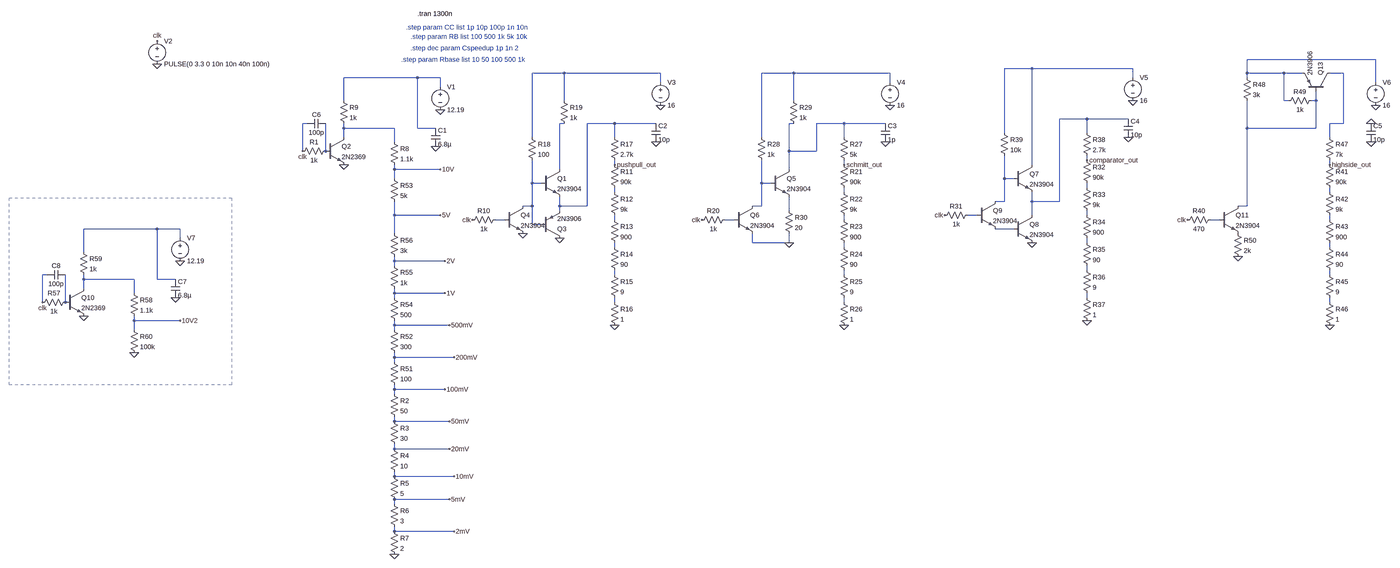
[diagram p0: schematic voltage_output.asc, whole sheet]
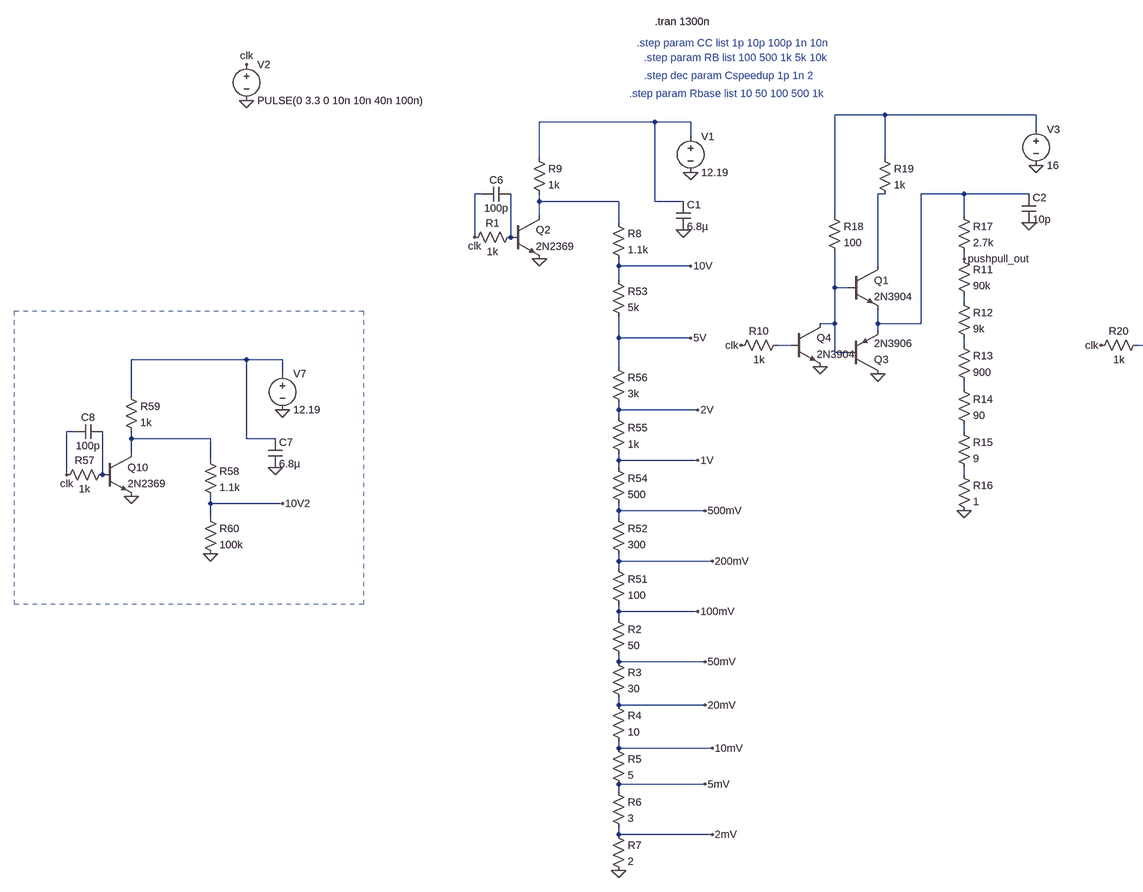
[diagram p1: schematic voltage_output.asc, part, row 1 of 1, column 1 of 2]
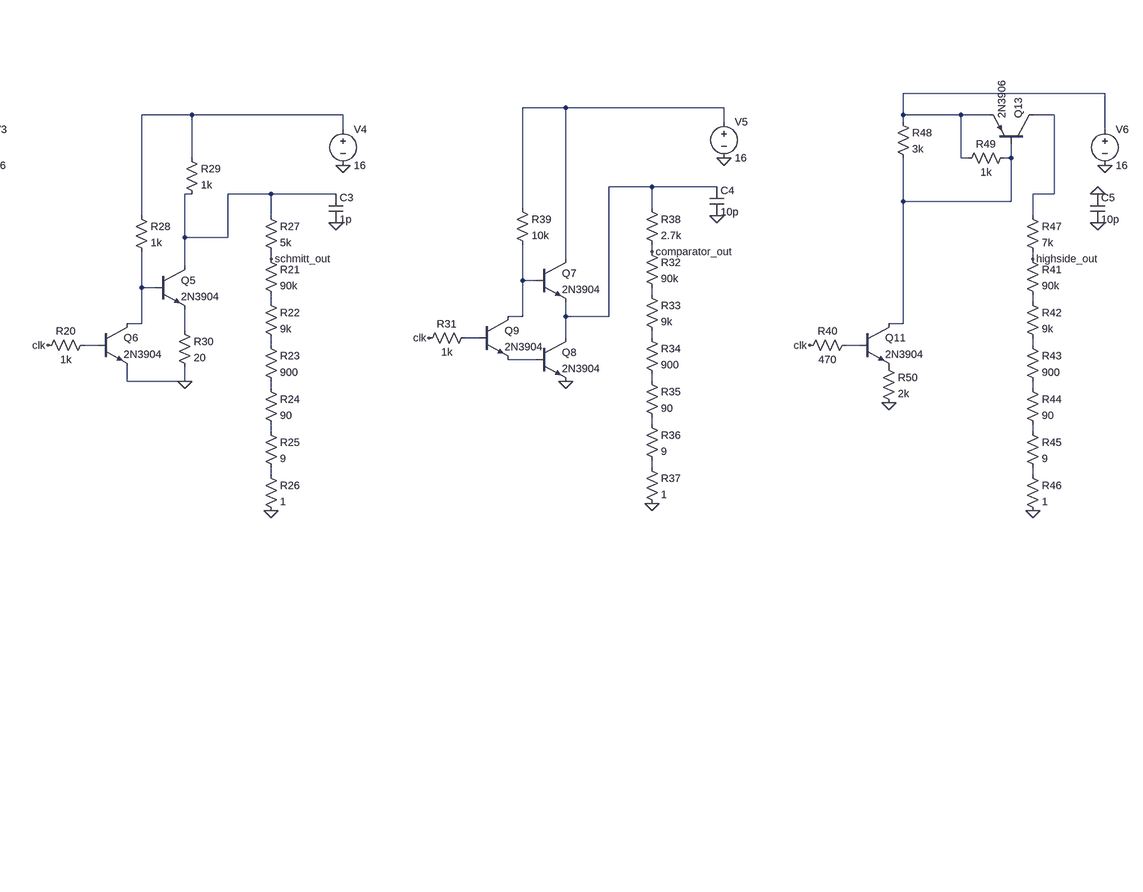
[diagram p2: schematic voltage_output.asc, part, row 1 of 1, column 2 of 2]
voltage_output.asc, the LTspice schematic file:
Version 4
SHEET 1 4044 1824
WIRE 3984 80 3536 80
WIRE 2784 112 2688 112
WIRE 3136 112 2784 112
WIRE 1120 128 1008 128
WIRE 1456 128 1120 128
WIRE 1920 128 1808 128
WIRE 2256 128 1920 128
WIRE 3536 128 3536 80
WIRE 3664 128 3536 128
WIRE 3728 128 3664 128
WIRE 3872 128 3824 128
WIRE 608 144 352 144
WIRE 688 144 608 144
WIRE 3136 144 3136 112
WIRE 3536 144 3536 128
WIRE 1456 160 1456 128
WIRE 2256 160 2256 128
WIRE 3984 160 3984 80
WIRE 688 176 688 144
WIRE 352 224 352 144
WIRE 1120 224 1120 128
WIRE 1920 224 1920 128
WIRE 3664 224 3664 128
WIRE 3680 224 3664 224
WIRE 3776 224 3776 192
WIRE 3776 224 3760 224
WIRE 2976 288 2880 288
WIRE 3120 288 2976 288
WIRE 224 304 208 304
WIRE 1120 304 1104 304
WIRE 1296 304 1200 304
WIRE 1440 304 1296 304
WIRE 1920 304 1904 304
WIRE 2096 304 2000 304
WIRE 2240 304 2096 304
WIRE 3872 304 3872 128
WIRE 3872 304 3824 304
WIRE 352 320 352 304
WIRE 528 320 352 320
WIRE 608 320 608 144
WIRE 672 320 608 320
WIRE 3536 320 3536 224
WIRE 3776 320 3776 224
WIRE 3776 320 3536 320
WIRE 2688 336 2688 112
WIRE 2976 336 2976 288
WIRE 352 352 352 320
WIRE 1008 352 1008 128
WIRE 1296 352 1296 304
WIRE 1808 352 1808 128
WIRE 2096 352 2096 304
WIRE 3824 352 3824 304
WIRE 528 368 528 320
WIRE 208 400 208 304
WIRE 288 400 288 304
WIRE 1904 400 1904 304
WIRE 2000 400 2000 304
WIRE 2000 400 1904 400
WIRE 2976 432 2976 416
WIRE 1296 448 1296 432
WIRE 2096 448 2096 432
WIRE 2784 448 2784 112
WIRE 3824 448 3824 432
WIRE 528 464 528 448
WIRE 688 464 528 464
WIRE 1104 464 1104 304
WIRE 1904 464 1904 400
WIRE 528 496 528 464
WIRE 2688 496 2688 416
WIRE 2720 496 2688 496
WIRE 1008 512 1008 432
WIRE 1040 512 1008 512
WIRE 1808 512 1808 432
WIRE 1840 512 1808 512
WIRE 2976 528 2976 512
WIRE 1296 544 1296 528
WIRE 2096 544 2096 528
WIRE 3824 544 3824 528
WIRE 2688 576 2688 496
WIRE 2688 576 2656 576
WIRE 2784 576 2784 544
WIRE 2880 576 2880 288
WIRE 2880 576 2784 576
WIRE 1008 592 1008 512
WIRE 1008 592 976 592
WIRE 1104 592 1104 560
WIRE 1200 592 1200 304
WIRE 1200 592 1104 592
WIRE 1808 592 1808 512
WIRE 1808 592 1776 592
WIRE 3536 592 3536 320
WIRE 3536 592 3504 592
WIRE 1104 608 1104 592
WIRE 1904 608 1904 560
WIRE 528 624 528 576
WIRE 688 624 528 624
WIRE 2592 624 2560 624
WIRE 2784 624 2784 576
WIRE 2976 624 2976 608
WIRE 912 640 880 640
WIRE 1296 640 1296 624
WIRE 1712 640 1680 640
WIRE 2096 640 2096 624
WIRE 3440 640 3408 640
WIRE 3824 640 3824 624
WIRE 1008 656 1008 592
WIRE 1040 656 1008 656
WIRE -464 672 -720 672
WIRE -384 672 -464 672
WIRE 2720 672 2656 672
WIRE 528 688 528 624
WIRE -384 704 -384 672
WIRE 1776 720 1776 688
WIRE 1904 720 1904 688
WIRE 1904 720 1776 720
WIRE 2976 720 2976 704
WIRE 1296 736 1296 720
WIRE 2096 736 2096 720
WIRE 3824 736 3824 720
WIRE -720 752 -720 672
WIRE 528 784 528 768
WIRE 704 784 528 784
WIRE 528 800 528 784
WIRE 2976 816 2976 800
WIRE -848 832 -864 832
WIRE 1296 832 1296 816
WIRE 2096 832 2096 816
WIRE 3824 832 3824 816
WIRE -720 848 -720 832
WIRE -544 848 -720 848
WIRE -464 848 -464 672
WIRE -400 848 -464 848
WIRE -720 880 -720 848
WIRE -544 896 -544 848
WIRE 528 896 528 880
WIRE 704 896 528 896
WIRE 528 912 528 896
WIRE 2976 912 2976 896
WIRE -864 928 -864 832
WIRE -784 928 -784 832
WIRE 1296 928 1296 912
WIRE 2096 928 2096 912
WIRE 3824 928 3824 912
WIRE -544 992 -544 976
WIRE -384 992 -544 992
WIRE 528 1008 528 992
WIRE 720 1008 528 1008
WIRE -544 1024 -544 992
WIRE 528 1024 528 1008
WIRE 528 1120 528 1104
WIRE 736 1120 528 1120
WIRE 528 1136 528 1120
WIRE 528 1232 528 1216
WIRE 704 1232 528 1232
WIRE 528 1248 528 1232
WIRE 528 1344 528 1328
WIRE 720 1344 528 1344
WIRE 528 1440 528 1424
WIRE 720 1440 528 1440
WIRE 528 1536 528 1520
WIRE 736 1536 528 1536
WIRE 720 1616 528 1616
WIRE 528 1632 528 1616
WIRE 528 1728 528 1712
WIRE 736 1728 528 1728
FLAG -464 96 0
FLAG -464 16 clk
FLAG 352 448 0
FLAG 528 1808 0
FLAG 688 256 0
FLAG 208 400 clk
FLAG 672 384 0
FLAG 1104 704 0
FLAG 1296 1008 0
FLAG 1456 240 0
FLAG 800 640 clk
FLAG 1440 368 0
FLAG 976 688 0
FLAG 1296 448 pushpull_out
FLAG 688 464 10V
FLAG 2096 1008 0
FLAG 2256 240 0
FLAG 1600 640 clk
FLAG 2240 368 0
FLAG 2096 448 schmitt_out
FLAG 1904 720 0
FLAG 2976 992 0
FLAG 3136 224 0
FLAG 2480 624 clk
FLAG 3120 352 0
FLAG 2784 720 0
FLAG 2976 432 comparator_out
FLAG 3824 1008 0
FLAG 3984 240 0
FLAG 3328 640 clk
FLAG 3968 368 0
FLAG 3824 448 highside_out
FLAG 3968 304 0
FLAG 3504 768 0
FLAG 688 624 5V
FLAG 704 784 2V
FLAG 736 1728 2mV
FLAG 720 1616 5mV
FLAG 736 1536 10mV
FLAG 720 1440 20mV
FLAG 720 1344 50mV
FLAG 704 1232 100mV
FLAG 736 1120 200mV
FLAG 720 1008 500mV
FLAG 704 896 1V
FLAG -720 976 0
FLAG -384 784 0
FLAG -864 928 clk
FLAG -400 912 0
FLAG -384 992 10V2
FLAG -544 1104 0
SYMBOL voltage -464 0 R0
SYMATTR InstName V2
SYMATTR Value PULSE(0 3.3 0 10n 10n 40n 100n)
SYMBOL npn 288 352 R0
SYMATTR InstName Q2
SYMATTR Value 2N2369
SYMBOL res 304 384 R90
WINDOW 0 0 56 VBottom 2
WINDOW 3 32 56 VTop 2
SYMATTR InstName R1
SYMATTR Value 1k
SYMBOL res 512 1232 R0
SYMATTR InstName R2
SYMATTR Value 50
SYMBOL res 512 1328 R0
SYMATTR InstName R3
SYMATTR Value 30
SYMBOL res 512 1424 R0
SYMATTR InstName R4
SYMATTR Value 10
SYMBOL res 512 1520 R0
SYMATTR InstName R5
SYMATTR Value 5
SYMBOL res 512 1616 R0
SYMATTR InstName R6
SYMATTR Value 3
SYMBOL res 512 1712 R0
SYMATTR InstName R7
SYMATTR Value 2
SYMBOL res 512 352 R0
SYMATTR InstName R8
SYMATTR Value 1.1k
SYMBOL res 336 208 R0
SYMATTR InstName R9
SYMATTR Value 1k
SYMBOL voltage 688 160 R0
SYMATTR InstName V1
SYMATTR Value 12.19
SYMBOL cap 656 320 R0
SYMATTR InstName C1
SYMATTR Value 6.8µ
SYMBOL npn 1040 464 R0
SYMATTR InstName Q1
SYMATTR Value 2N3904
SYMBOL res 896 624 R90
WINDOW 0 0 56 VBottom 2
WINDOW 3 32 56 VTop 2
SYMATTR InstName R10
SYMATTR Value 1k
SYMBOL res 1280 432 R0
SYMATTR InstName R11
SYMATTR Value 90k
SYMBOL res 1280 528 R0
SYMATTR InstName R12
SYMATTR Value 9k
SYMBOL res 1280 624 R0
SYMATTR InstName R13
SYMATTR Value 900
SYMBOL res 1280 720 R0
SYMATTR InstName R14
SYMATTR Value 90
SYMBOL res 1280 816 R0
SYMATTR InstName R15
SYMATTR Value 9
SYMBOL res 1280 912 R0
SYMATTR InstName R16
SYMATTR Value 1
SYMBOL res 1280 336 R0
SYMATTR InstName R17
SYMATTR Value 2.7k
SYMBOL voltage 1456 144 R0
SYMATTR InstName V3
SYMATTR Value 16
SYMBOL cap 1424 304 R0
SYMATTR InstName C2
SYMATTR Value 10p
SYMBOL pnp 1040 704 M180
SYMATTR InstName Q3
SYMATTR Value 2N3906
SYMBOL npn 912 592 R0
SYMATTR InstName Q4
SYMATTR Value 2N3904
SYMBOL res 992 336 R0
SYMATTR InstName R18
SYMATTR Value 100
SYMBOL res 1104 208 R0
SYMATTR InstName R19
SYMATTR Value 1k
SYMBOL npn 1840 464 R0
SYMATTR InstName Q5
SYMATTR Value 2N3904
SYMBOL res 1696 624 R90
WINDOW 0 0 56 VBottom 2
WINDOW 3 32 56 VTop 2
SYMATTR InstName R20
SYMATTR Value 1k
SYMBOL res 2080 432 R0
SYMATTR InstName R21
SYMATTR Value 90k
SYMBOL res 2080 528 R0
SYMATTR InstName R22
SYMATTR Value 9k
SYMBOL res 2080 624 R0
SYMATTR InstName R23
SYMATTR Value 900
SYMBOL res 2080 720 R0
SYMATTR InstName R24
SYMATTR Value 90
SYMBOL res 2080 816 R0
SYMATTR InstName R25
SYMATTR Value 9
SYMBOL res 2080 912 R0
SYMATTR InstName R26
SYMATTR Value 1
SYMBOL res 2080 336 R0
SYMATTR InstName R27
SYMATTR Value 5k
SYMBOL voltage 2256 144 R0
SYMATTR InstName V4
SYMATTR Value 16
SYMBOL cap 2224 304 R0
SYMATTR InstName C3
SYMATTR Value 1p
SYMBOL res 1792 336 R0
SYMATTR InstName R28
SYMATTR Value 1k
SYMBOL res 1904 208 R0
SYMATTR InstName R29
SYMATTR Value 1k
SYMBOL res 1888 592 R0
SYMATTR InstName R30
SYMATTR Value 20
SYMBOL npn 1712 592 R0
SYMATTR InstName Q6
SYMATTR Value 2N3904
SYMBOL npn 2720 448 R0
SYMATTR InstName Q7
SYMATTR Value 2N3904
SYMBOL res 2576 608 R90
WINDOW 0 0 56 VBottom 2
WINDOW 3 32 56 VTop 2
SYMATTR InstName R31
SYMATTR Value 1k
SYMBOL res 2960 416 R0
SYMATTR InstName R32
SYMATTR Value 90k
SYMBOL res 2960 512 R0
SYMATTR InstName R33
SYMATTR Value 9k
SYMBOL res 2960 608 R0
SYMATTR InstName R34
SYMATTR Value 900
SYMBOL res 2960 704 R0
SYMATTR InstName R35
SYMATTR Value 90
SYMBOL res 2960 800 R0
SYMATTR InstName R36
SYMATTR Value 9
SYMBOL res 2960 896 R0
SYMATTR InstName R37
SYMATTR Value 1
SYMBOL res 2960 320 R0
SYMATTR InstName R38
SYMATTR Value 2.7k
SYMBOL voltage 3136 128 R0
SYMATTR InstName V5
SYMATTR Value 16
SYMBOL cap 3104 288 R0
SYMATTR InstName C4
SYMATTR Value 10p
SYMBOL npn 2592 576 R0
SYMATTR InstName Q9
SYMATTR Value 2N3904
SYMBOL res 2672 320 R0
SYMATTR InstName R39
SYMATTR Value 10k
SYMBOL npn 2720 624 R0
SYMATTR InstName Q8
SYMATTR Value 2N3904
SYMBOL res 3424 624 R90
WINDOW 0 0 56 VBottom 2
WINDOW 3 32 56 VTop 2
SYMATTR InstName R40
SYMATTR Value 470
SYMBOL res 3808 432 R0
SYMATTR InstName R41
SYMATTR Value 90k
SYMBOL res 3808 528 R0
SYMATTR InstName R42
SYMATTR Value 9k
SYMBOL res 3808 624 R0
SYMATTR InstName R43
SYMATTR Value 900
SYMBOL res 3808 720 R0
SYMATTR InstName R44
SYMATTR Value 90
SYMBOL res 3808 816 R0
SYMATTR InstName R45
SYMATTR Value 9
SYMBOL res 3808 912 R0
SYMATTR InstName R46
SYMATTR Value 1
SYMBOL res 3808 336 R0
SYMATTR InstName R47
SYMATTR Value 7k
SYMBOL voltage 3984 144 R0
SYMATTR InstName V6
SYMATTR Value 16
SYMBOL cap 3952 304 R0
SYMATTR InstName C5
SYMATTR Value 10p
SYMBOL npn 3440 592 R0
SYMATTR InstName Q11
SYMATTR Value 2N3904
SYMBOL res 3520 128 R0
SYMATTR InstName R48
SYMATTR Value 3k
SYMBOL pnp 3824 192 M270
SYMATTR InstName Q13
SYMATTR Value 2N3906
SYMBOL res 3776 208 R90
WINDOW 0 0 56 VBottom 2
WINDOW 3 32 56 VTop 2
SYMATTR InstName R49
SYMATTR Value 1k
SYMBOL res 3488 672 R0
SYMATTR InstName R50
SYMATTR Value 2k
SYMBOL res 512 1120 R0
SYMATTR InstName R51
SYMATTR Value 100
SYMBOL res 512 1008 R0
SYMATTR InstName R52
SYMATTR Value 300
SYMBOL res 512 480 R0
SYMATTR InstName R53
SYMATTR Value 5k
SYMBOL res 512 896 R0
SYMATTR InstName R54
SYMATTR Value 500
SYMBOL res 512 784 R0
SYMATTR InstName R55
SYMATTR Value 1k
SYMBOL res 512 672 R0
SYMATTR InstName R56
SYMATTR Value 3k
SYMBOL cap 288 288 R90
WINDOW 0 0 32 VBottom 2
WINDOW 3 32 32 VTop 2
SYMATTR InstName C6
SYMATTR Value 100p
SYMBOL npn -784 880 R0
SYMATTR InstName Q10
SYMATTR Value 2N2369
SYMBOL res -768 912 R90
WINDOW 0 0 56 VBottom 2
WINDOW 3 32 56 VTop 2
SYMATTR InstName R57
SYMATTR Value 1k
SYMBOL res -560 880 R0
SYMATTR InstName R58
SYMATTR Value 1.1k
SYMBOL res -736 736 R0
SYMATTR InstName R59
SYMATTR Value 1k
SYMBOL voltage -384 688 R0
SYMATTR InstName V7
SYMATTR Value 12.19
SYMBOL cap -416 848 R0
SYMATTR InstName C7
SYMATTR Value 6.8µ
SYMBOL res -560 1008 R0
SYMATTR InstName R60
SYMATTR Value 100k
SYMBOL cap -784 816 R90
WINDOW 0 0 32 VBottom 2
WINDOW 3 32 32 VTop 2
SYMATTR InstName C8
SYMATTR Value 100p
TEXT 608 -80 Left 2 !.tran 1300n
TEXT 568 -32 Left 2 ;.step param CC list 1p 10p 100p 1n 10n
TEXT 584 0 Left 2 ;.step param RB list 100 500 1k 5k 10k
TEXT 584 40 Left 2 ;.step dec param Cspeedup 1p 1n 2
TEXT 552 80 Left 2 ;.step param Rbase list 10 50 100 500 1k
RECTANGLE Normal -980 564 -204 1216 2

The netlist it stands for:
* voltage_output.asc
V2 clk 0 PULSE(0 3.3 0 10n 10n 40n 100n)
Q2 N012 N013 0 0 2N2369
R1 N013 clk 1k
R2 100mV 50mV 50
R3 50mV 20mV 30
R4 20mV 10mV 10
R5 10mV 5mV 5
R6 5mV 2mV 3
R7 2mV 0 2
R8 N012 10V 1.1k
R9 N006 N012 1k
V1 N006 0 12.19
C1 N006 0 6.8µ
Q1 N009 N015 N010 0 2N3904
R10 N024 clk 1k
R11 pushpull_out N018 90k
R12 N018 N025 9k
R13 N025 N033 900
R14 N033 N037 90
R15 N037 N043 9
R16 N043 0 1
R17 N010 pushpull_out 2.7k
V3 N003 0 16
C2 N010 0 10p
Q3 0 N015 N010 0 2N3906
Q4 N015 N024 0 0 2N3904
R18 N003 N015 100
R19 N003 N009 1k
Q5 N011 N016 N021 0 2N3904
R20 N026 clk 1k
R21 schmitt_out N019 90k
R22 N019 N027 9k
R23 N027 N034 900
R24 N034 N038 90
R25 N038 N044 9
R26 N044 0 1
R27 N011 schmitt_out 5k
V4 N004 0 16
C3 N011 0 1p
R28 N004 N016 1k
R29 N004 N011 1k
R30 N021 0 20
Q6 N016 N026 0 0 2N3904
Q7 N002 N014 N008 0 2N3904
R31 N022 clk 1k
R32 comparator_out N017 90k
R33 N017 N023 9k
R34 N023 N032 900
R35 N032 N036 90
R36 N036 N041 9
R37 N041 0 1
R38 N008 comparator_out 2.7k
V5 N002 0 16
C4 N008 0 10p
Q9 N014 N022 N031 0 2N3904
R39 N002 N014 10k
Q8 N008 N031 0 0 2N3904
R40 N028 clk 470
R41 highside_out N020 90k
R42 N020 N029 9k
R43 N029 N035 900
R44 N035 N039 90
R45 N039 N045 9
R46 N045 0 1
R47 N005 highside_out 7k
V6 N001 0 16
C5 0 0 10p
Q11 N007 N028 P001 0 2N3904
R48 N001 N007 3k
Q13 N005 N007 N001 0 2N3906
R49 N007 N001 1k
R50 P001 0 2k
R51 200mV 100mV 100
R52 500mV 200mV 300
R53 10V 5V 5k
R54 1V 500mV 500
R55 2V 1V 1k
R56 5V 2V 3k
C6 N013 clk 100p
Q10 N040 N042 0 0 2N2369
R57 N042 clk 1k
R58 N040 10V2 1.1k
R59 N030 N040 1k
V7 N030 0 12.19
C7 N030 0 6.8µ
R60 10V2 0 100k
C8 N042 clk 100p
.model NPN NPN
.model PNP PNP
.lib standard.bjt
.tran 1300n
* .step param CC list 1p 10p 100p 1n 10n
* .step param RB list 100 500 1k 5k 10k
* .step dec param Cspeedup 1p 1n 2
* .step param Rbase list 10 50 100 500 1k
.backanno
.end